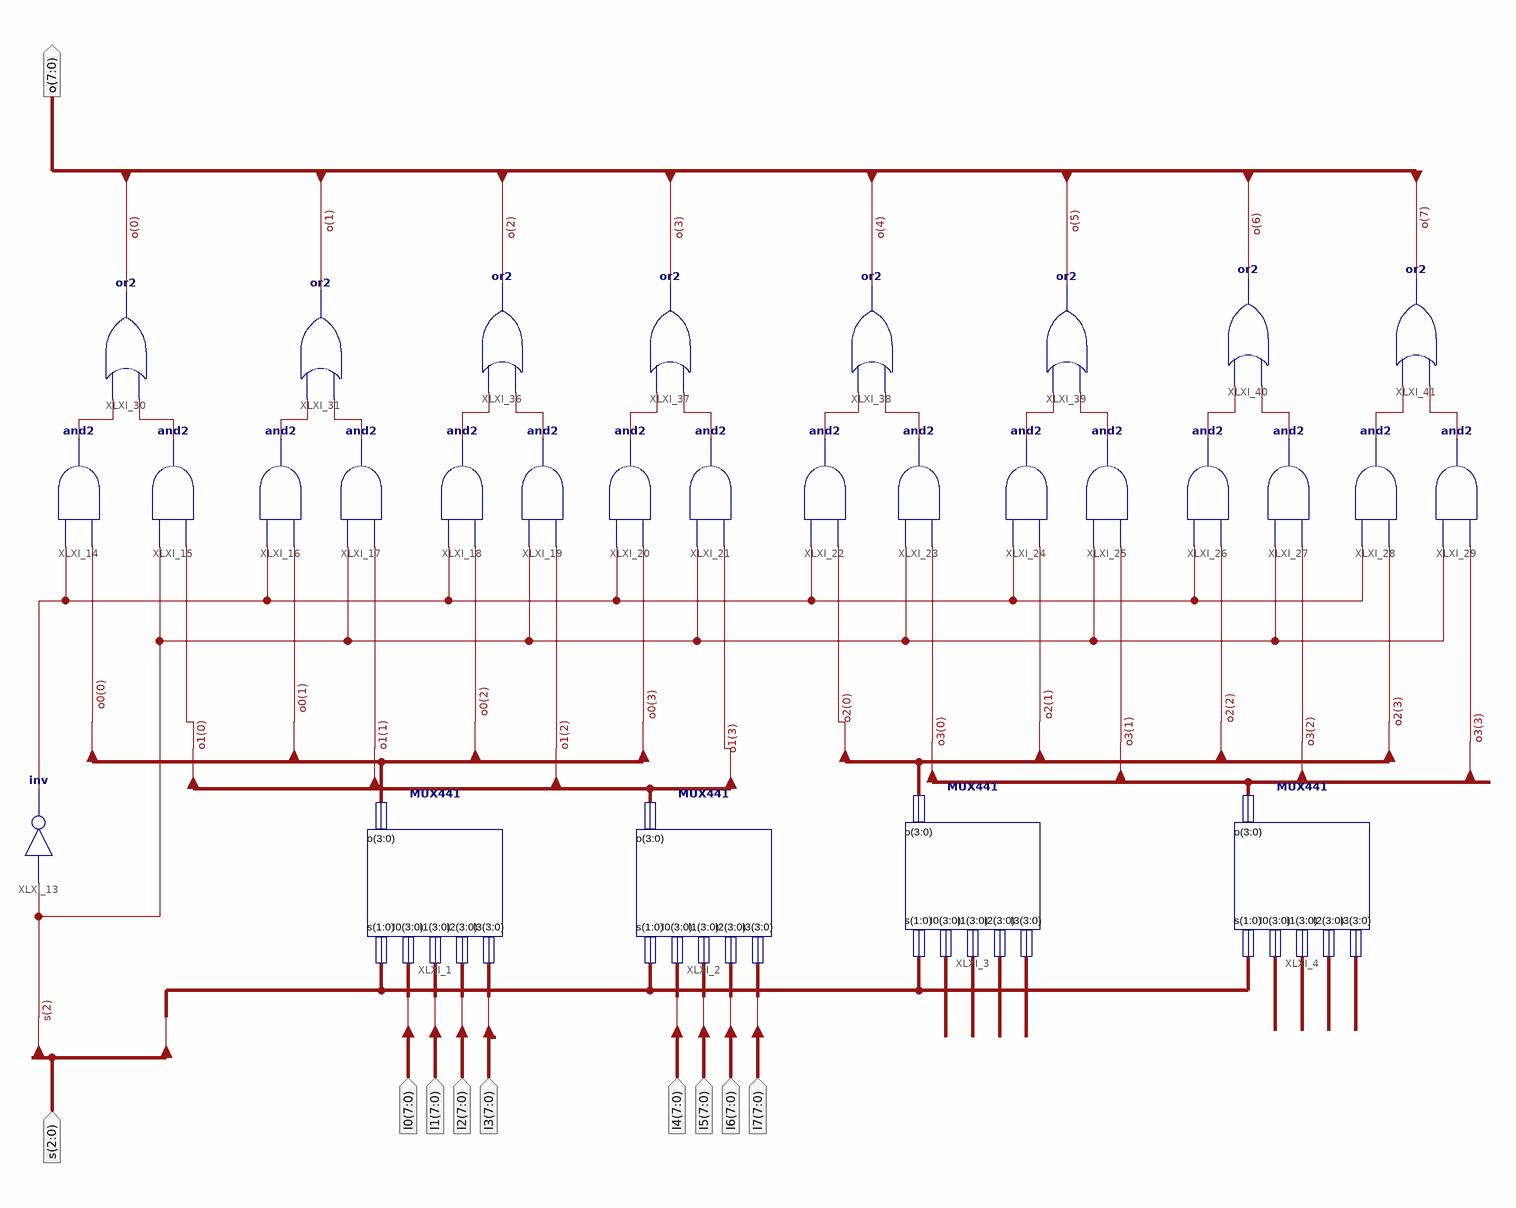
[diagram p0: schematic sheet 1]
// Xilinx ISE schematic ExMUX_sch.sch (kintex7) as structural Verilog: 29 symbols, 10 ports
module ExMUX_sch (
  input  [2:0] s,
  input  [7:0] I0,
  input  [7:0] I1,
  input  [7:0] I2,
  input  [7:0] I3,
  input  [7:0] I4,
  input  [7:0] I5,
  input  [7:0] I6,
  input  [7:0] I7,
  output [7:0] o
);

  wire XLXN_36, XLXN_92, XLXN_93, XLXN_94, XLXN_95, XLXN_96, XLXN_97, XLXN_98, XLXN_99, XLXN_100, XLXN_101,
       XLXN_102, XLXN_103, XLXN_104, XLXN_105, XLXN_106, XLXN_107;
  wire [3:0] o0, o1, o2, o3;

  MUX441 XLXI_2 (.s(s[1:0]), .I0(I4[3:0]), .I1(I5[3:0]), .I2(I6[3:0]), .I3(I7[3:0]), .o(o1));
  MUX441 XLXI_1 (.s(s[1:0]), .I0(I0[3:0]), .I1(I1[3:0]), .I2(I2[3:0]), .I3(I3[3:0]), .o(o0));
  MUX441 XLXI_3 (.s(s[1:0]), .I0(I0[7:4]), .I1(I1[7:4]), .I2(I2[7:4]), .I3(I3[7:4]), .o(o2));
  MUX441 XLXI_4 (.s(s[1:0]), .I0(I4[7:4]), .I1(I5[7:4]), .I2(I6[7:4]), .I3(I7[7:4]), .o(o3));
  not XLXI_13 (XLXN_36, s[2]);
  and XLXI_14 (XLXN_92, o0[0], XLXN_36);
  and XLXI_15 (XLXN_93, o1[0], s[2]);
  and XLXI_16 (XLXN_94, o0[1], XLXN_36);
  and XLXI_17 (XLXN_95, o1[1], s[2]);
  and XLXI_18 (XLXN_96, o0[2], XLXN_36);
  and XLXI_19 (XLXN_97, o1[2], s[2]);
  and XLXI_20 (XLXN_98, o0[3], XLXN_36);
  and XLXI_21 (XLXN_99, o1[3], s[2]);
  and XLXI_22 (XLXN_100, o2[0], XLXN_36);
  and XLXI_23 (XLXN_101, o3[0], s[2]);
  and XLXI_24 (XLXN_102, o2[1], XLXN_36);
  and XLXI_25 (XLXN_103, o3[1], s[2]);
  and XLXI_26 (XLXN_104, o2[2], XLXN_36);
  and XLXI_27 (XLXN_105, o3[2], s[2]);
  and XLXI_28 (XLXN_106, o2[3], XLXN_36);
  and XLXI_29 (XLXN_107, o3[3], s[2]);
  or XLXI_30 (o[0], XLXN_93, XLXN_92);
  or XLXI_31 (o[1], XLXN_95, XLXN_94);
  or XLXI_36 (o[2], XLXN_97, XLXN_96);
  or XLXI_37 (o[3], XLXN_99, XLXN_98);
  or XLXI_38 (o[4], XLXN_101, XLXN_100);
  or XLXI_39 (o[5], XLXN_103, XLXN_102);
  or XLXI_40 (o[6], XLXN_105, XLXN_104);
  or XLXI_41 (o[7], XLXN_107, XLXN_106);
endmodule
